# EasyEDA Pro project Sensor_colis_examples.epro, board 2024-06-03_06-32-39
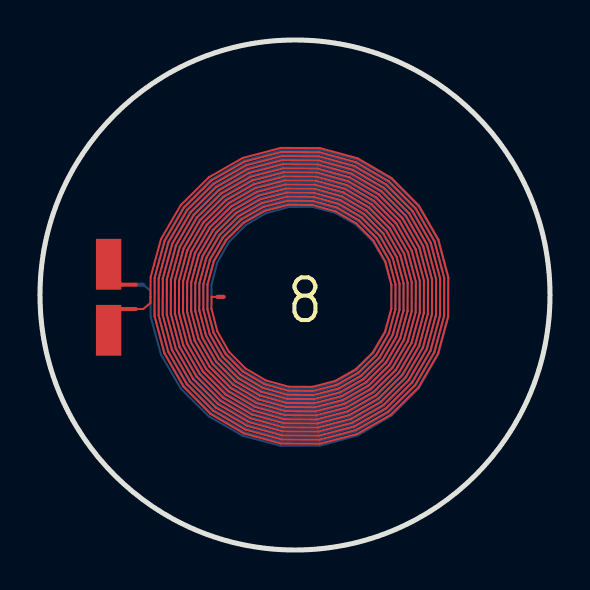
[diagram p14: board, top side]
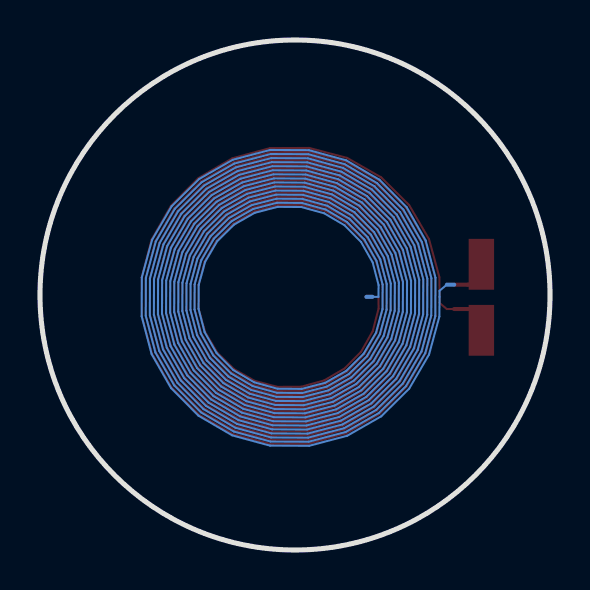
[diagram p15: board, bottom side, seen from below]

Outline 25.51 x 25.51 mm; copper layers: Top Layer, MidLayer1, MidLayer2, Bottom Layer. Coordinates in mm from the lower left corner of the outline.
Outline path: circle c12.75,12.75 r12.75
Stack: Top Layer 0.0356mm / SUBSTRATE1 0.32mm FR-4 er 4.8 / SUBSTRATE4 0.32mm FR-4 er 4.8 / SUBSTRATE5 0.32mm FR-4 er 4.8 / MidLayer1 0.0356mm / SUBSTRATE2 0.32mm FR-4 er 4.8 / MidLayer2 0.0356mm / SUBSTRATE3 0.32mm FR-4 er 4.8 / Bottom Layer 0.0356mm

## Design rules (mm)
spacing safeClearance (default): track to track 0.152, other pairs 0.152 to 0.3
track width trackWidth (default): min 0.127, default 0.254, max 2.54
differential pair differentialPair (default): width min 0.127, default 0.254, max 2.54; gap min 0.152, default 0.152
via viaSize (default): diameter min 0.5, default 0.61, max 10; hole min 0.3, default 0.305, max 6

## Placement (name value [footprint] x y rotation side)
CSENSOR  -  [0402]  3.43 12.75 90 top

## Footprints (pads in the part's own frame, mm; a bottom-side part is the same pattern mirrored in y, then rotated)
0402
  rect 2.54x1.27 smd: 1(-1.766,0) 2(1.536,0)

## Nets
3: CSENSOR.1 CSENSOR.2

## Routing (per net, layer and track width the routed paths; a pad name or vN(x,y) marks a point on that pad's centre or on a via; arc(x,y) is an arc through that point)
3: length 1138.4
  Top Layer w0.102: 4.79,12.05 5.16,12.05 5.53,12.36 5.53,12.66 5.53,13.65 6.05,15.55 7.04,17.25 8.44,18.64 10.15,19.61 12.04,20.11 14,20.1 15.89,19.59 17.58,18.6 18.96,17.21 19.93,15.52 20.42,13.64 20.41,11.69 19.9,9.81 18.92,8.13 17.55,6.77 15.86,5.81 13.99,5.31 12.06,5.32 10.2,5.83 8.53,6.8 7.17,8.17 6.22,9.84 5.73,11.7 5.74,13.62 6.24,15.47 7.21,17.13 8.57,18.47 10.22,19.42 12.07,19.91 13.98,19.9 15.82,19.4 17.46,18.44 18.8,17.09 19.74,15.44 20.22,13.61 20.21,11.72 19.71,9.89 18.76,8.26 17.42,6.93 15.79,6 13.97,5.52 12.09,5.53 10.27,6.02 8.65,6.96 7.34,8.3 6.41,9.92 5.93,11.73 5.94,13.59 6.43,15.39 7.37,17 8.69,18.31 10.3,19.23 12.1,19.7 13.95,19.69 15.74,19.21 17.33,18.28 18.63,16.96 19.55,15.36 20.02,13.58 20.01,11.74 19.52,9.97 18.6,8.38 17.3,7.09 15.71,6.19 13.94,5.72 12.11,5.73 10.35,6.21 8.78,7.13 7.5,8.42 6.6,10 6.13,11.75 6.14,13.57 6.62,15.31 7.53,16.88 8.82,18.15 10.38,19.04 12.12,19.5 13.92,19.49 15.66,19.02 17.21,18.11 18.47,16.84 19.36,15.28 19.81,13.55 19.8,11.77 19.33,10.05 18.44,8.51 17.17,7.26 15.63,6.37 13.91,5.92 12.14,5.93 10.43,6.4 8.9,7.29 7.66,8.54 6.79,10.08 6.34,11.78 6.35,13.54 6.81,15.24 7.69,16.75 8.94,17.98 10.46,18.85 12.15,19.3 13.9,19.29 15.58,18.83 17.08,17.95 18.31,16.71 19.17,15.21 19.61,13.53 19.6,11.8 19.15,10.13 18.27,8.63 17.05,7.42 15.55,6.56 13.89,6.13 12.17,6.14 10.51,6.59 9.03,7.45 7.82,8.67 6.98,10.16 6.54,11.81 6.55,13.51 7,15.16 7.86,16.63 9.06,17.82 10.54,18.66 12.18,19.09 13.87,19.09 15.5,18.64 16.96,17.79 18.15,16.59 18.98,15.13 19.41,13.5 19.4,11.82 18.96,10.2 18.11,8.76 16.92,7.58 15.47,6.75 13.86,6.33 12.19,6.34 10.59,6.78 9.15,7.62 7.99,8.79 7.16,10.23 6.74,11.83 6.75,13.49 7.19,15.08 8.02,16.5 9.19,17.66 10.62,18.47 12.2,18.89 13.84,18.88 15.42,18.45 16.83,17.63 17.98,16.47 18.79,15.05 19.2,13.47 19.2,11.85 18.77,10.28 17.95,8.88 16.8,7.74 15.39,6.94 13.83,6.53 12.22,6.54 10.67,6.97 9.28,7.78 8.15,8.92 7.35,10.31 6.95,11.86 6.96,13.46 7.38,15 8.18,16.38 9.31,17.5 10.7,18.28 12.23,18.69 13.82,18.68 15.34,18.26 16.71,17.46 17.82,16.34 18.6,14.97 19,13.45 18.99,11.88 18.58,10.36 17.79,9.01 16.67,7.91 15.32,7.13 13.8,6.74 12.25,6.74 10.74,7.16 9.4,7.94 8.31,9.04 7.54,10.39 7.15,11.89 7.16,13.43 7.57,14.92 8.34,16.25 9.44,17.33 10.77,18.1 12.26,18.48 13.79,18.48 15.27,18.07 16.58,17.3 17.66,16.22 18.41,14.89 18.8,13.42 18.79,11.9 18.39,10.44 17.62,9.13 16.55,8.07 15.24,7.32 13.78,6.94 12.27,6.95 10.82,7.35 9.53,8.1 8.47,9.17 7.73,10.47 7.35,11.91 7.36,13.41 7.76,14.84 8.51,16.13 9.56,17.17 10.85,17.91 12.28,18.28 13.76,18.27 15.19,17.88 16.46,17.14 17.49,16.09 18.22,14.81 18.59,13.39 18.59,11.93 18.2,10.52 17.46,9.26 16.42,8.23 15.16,7.51 13.75,7.14 12.3,7.15 10.9,7.53 9.65,8.27 8.64,9.29 7.92,10.55 7.56,11.94 7.57,13.38 7.95,14.76 8.67,16 9.69,17.01 10.93,17.72 12.31,18.08 13.74,18.07 15.11,17.69 16.34,16.98 17.33,15.97 18.03,14.74 18.39,13.37 18.38,11.96 18.01,10.6 17.3,9.38 16.3,8.39 15.08,7.7 13.72,7.35 12.33,7.35 10.98,7.72 9.78,8.43 8.8,9.42 8.11,10.63 7.76,11.97 7.77,13.35 8.14,14.69 8.83,15.88 9.81,16.85 11.01,17.53 12.34,17.87 13.71,17.87 15.03,17.5 16.21,16.81 17.17,15.84 17.84,14.66 18.19,13.34 18.18,11.98 17.82,10.67 17.14,9.51 16.17,8.56 15,7.89 13.7,7.55 12.35,7.56 11.06,7.91 9.9,8.59 8.96,9.54 8.3,10.7 7.96,11.99 7.97,13.33 8.32,14.61 9,15.75 9.94,16.68 11.09,17.34 12.37,17.67 13.68,17.66 14.95,17.31 16.09,16.65 17.01,15.72 17.65,14.58 17.98,13.31 17.98,12.01 17.63,10.75 16.97,9.63 16.05,8.72 14.92,8.08 13.67,7.75 12.38,7.76 11.14,8.1 10.03,8.75 9.12,9.67 8.49,10.78 8.17,12.02 8.18,13.3 8.51,14.53 9.16,15.63 10.06,16.52 11.17,17.15 12.39,17.47 13.66,17.46 14.87,17.12 15.96,16.49 16.84,15.59 17.46,14.5 17.78,13.29 17.77,12.04 17.44,10.83 16.81,9.76 15.92,8.88 14.84,8.27 13.64,7.96 12.41,7.96 11.22,8.29 10.15,8.92 9.29,9.79 8.68,10.86 8.37,12.05 8.38,13.27 8.7,14.45 9.32,15.5 10.19,16.36 11.24,16.96 12.42,17.27 13.63,17.26 14.8,16.94 15.84,16.32 16.68,15.47 17.28,14.42 17.58,13.26 17.57,12.06 17.25,10.91 16.65,9.88 15.8,9.04 14.77,8.46 13.62,8.16 12.43,8.17 11.29,8.48 10.28,9.08 9.45,9.92 8.87,10.94 8.57,12.08 8.58,12.66 8.88,12.66
  Top Layer w0.203: 4.79,12.05 3.43,12.05 ; 8.88,12.66 9.18,12.66 ; 3.43,13.45 3.43,13.36 4.11,13.27 4.79,13.27
  Bottom Layer w0.102: 8.88,12.66 8.58,12.66 8.57,13.25 8.87,14.38 9.45,15.4 10.28,16.24 11.29,16.84 12.43,17.15 13.62,17.16 14.77,16.86 15.8,16.28 16.65,15.44 17.25,14.41 17.57,13.26 17.58,12.06 17.28,10.9 16.68,9.86 15.84,9 14.8,8.39 13.63,8.07 12.42,8.06 11.24,8.36 10.19,8.96 9.32,9.82 8.7,10.87 8.38,12.05 8.37,13.27 8.68,14.46 9.29,15.53 10.15,16.41 11.22,17.03 12.41,17.36 13.64,17.37 14.84,17.05 15.92,16.44 16.81,15.57 17.44,14.49 17.77,13.29 17.78,12.03 17.46,10.82 16.84,9.73 15.96,8.83 14.87,8.2 13.66,7.86 12.39,7.85 11.17,8.17 10.06,8.8 9.16,9.69 8.51,10.79 8.18,12.02 8.17,13.3 8.49,14.54 9.12,15.65 10.03,16.57 11.14,17.22 12.38,17.56 13.67,17.57 14.92,17.24 16.05,16.6 16.97,15.69 17.63,14.57 17.98,13.31 17.98,12.01 17.65,10.74 17.01,9.61 16.09,8.67 14.95,8.01 13.68,7.66 12.37,7.65 11.09,7.98 9.94,8.64 9,9.57 8.32,10.71 7.97,12 7.96,13.33 8.3,14.62 8.96,15.78 9.9,16.73 11.06,17.41 12.35,17.76 13.7,17.77 15,17.43 16.17,16.77 17.14,15.82 17.82,14.65 18.18,13.34 18.19,11.98 17.84,10.67 17.17,9.48 16.21,8.51 15.03,7.82 13.71,7.46 12.34,7.45 11.01,7.79 9.81,8.48 8.83,9.44 8.14,10.64 7.77,11.97 7.76,13.35 8.11,14.7 8.8,15.9 9.78,16.89 10.98,17.6 12.33,17.97 13.72,17.98 15.08,17.62 16.3,16.93 17.3,15.94 18.01,14.73 18.38,13.37 18.39,11.95 18.03,10.59 17.33,9.36 16.34,8.35 15.11,7.63 13.74,7.25 12.31,7.24 10.93,7.61 9.69,8.31 8.67,9.32 7.95,10.56 7.57,11.94 7.56,13.38 7.92,14.77 8.64,16.03 9.65,17.06 10.9,17.79 12.3,18.17 13.75,18.18 15.16,17.81 16.42,17.09 17.46,16.07 18.2,14.8 18.59,13.39 18.59,11.93 18.22,10.51 17.49,9.23 16.46,8.18 15.19,7.44 13.76,7.05 12.28,7.04 10.85,7.42 9.56,8.15 8.51,9.19 7.76,10.48 7.36,11.92 7.35,13.41 7.73,14.85 8.47,16.15 9.53,17.22 10.82,17.98 12.27,18.37 13.78,18.38 15.24,18 16.55,17.25 17.62,16.19 18.39,14.88 18.79,13.42 18.8,11.9 18.41,10.43 17.66,9.11 16.58,8.02 15.27,7.25 13.79,6.85 12.26,6.84 10.77,7.23 9.44,7.99 8.34,9.07 7.57,10.4 7.16,11.89 7.15,13.43 7.54,14.93 8.31,16.28 9.4,17.38 10.74,18.17 12.25,18.58 13.8,18.59 15.32,18.19 16.67,17.42 17.79,16.31 18.58,14.96 18.99,13.45 19,11.87 18.6,10.35 17.82,8.98 16.71,7.86 15.34,7.06 13.82,6.64 12.23,6.63 10.7,7.04 9.31,7.83 8.18,8.95 7.38,10.32 6.96,11.86 6.95,13.46 7.35,15.01 8.15,16.4 9.28,17.54 10.67,18.36 12.22,18.78 13.83,18.79 15.39,18.38 16.8,17.58 17.95,16.44 18.77,15.04 19.2,13.47 19.2,11.85 18.79,10.27 17.98,8.86 16.83,7.7 15.42,6.87 13.84,6.44 12.2,6.43 10.62,6.85 9.19,7.66 8.02,8.82 7.19,10.24 6.75,11.84 6.74,13.49 7.16,15.09 7.99,16.53 9.15,17.71 10.59,18.55 12.19,18.98 13.86,18.99 15.47,18.57 16.92,17.74 18.11,16.56 18.96,15.12 19.4,13.5 19.41,11.82 18.98,10.19 18.15,8.73 16.96,7.53 15.5,6.68 13.87,6.24 12.18,6.23 10.54,6.66 9.06,7.5 7.86,8.7 7,10.17 6.55,11.81 6.54,13.51 6.98,15.17 7.82,16.65 9.03,17.87 10.51,18.73 12.17,19.19 13.89,19.2 15.55,18.76 17.05,17.9 18.27,16.69 19.15,15.2 19.6,13.53 19.61,11.79 19.17,10.12 18.31,8.61 17.08,7.37 15.58,6.49 13.9,6.03 12.15,6.03 10.46,6.47 8.94,7.34 7.69,8.57 6.81,10.09 6.35,11.78 6.34,13.54 6.79,15.25 7.66,16.78 8.9,18.03 10.43,18.92 12.14,19.39 13.91,19.4 15.63,18.95 17.17,18.07 18.44,16.81 19.33,15.27 19.8,13.55 19.81,11.77 19.36,10.04 18.47,8.48 17.21,7.21 15.66,6.3 13.92,5.83 12.12,5.82 10.38,6.28 8.82,7.17 7.53,8.45 6.62,10.01 6.14,11.76 6.13,13.57 6.6,15.32 7.5,16.9 8.78,18.19 10.35,19.11 12.11,19.59 13.94,19.6 15.71,19.14 17.3,18.23 18.6,16.94 19.52,15.35 20.01,13.58 20.02,11.74 19.55,9.96 18.63,8.36 17.33,7.05 15.74,6.11 13.95,5.63 12.1,5.62 10.3,6.09 8.69,7.01 7.37,8.32 6.43,9.93 5.94,11.73 5.93,13.59 6.41,15.4 7.34,17.03 8.65,18.36 10.27,19.3 12.09,19.8 13.97,19.81 15.79,19.33 17.42,18.39 18.76,17.06 19.71,15.43 20.21,13.61 20.22,11.71 19.74,9.88 18.8,8.23 17.46,6.88 15.82,5.93 13.98,5.42 12.07,5.42 10.22,5.9 8.57,6.85 7.21,8.2 6.24,9.85 5.74,11.7 5.73,13.62 6.22,15.48 7.17,17.15 8.53,18.52 10.2,19.49 12.06,20 13.99,20.01 15.86,19.52 17.55,18.55 18.92,17.19 19.9,15.51 20.41,13.63 20.42,11.69 19.93,9.8 18.96,8.11 17.58,6.72 15.89,5.74 14,5.22 12.04,5.21 10.15,5.71 8.44,6.69 7.04,8.07 6.05,9.77 5.53,11.67 5.53,12.66 5.53,12.97 5.16,13.27
  Bottom Layer w0.203: 8.88,12.66 9.18,12.66 ; 5.16,13.27 4.79,13.27

## Text on the board
Top Silkscreen Layer: Layers = 2 | Turns = 15 | Version - 1.1 | -------------- | Design Id - 110 | Coil Parameters | Customized for LDC1612 | Trace Width = 4.0 mils | Layer Stack Information | Trace Spacing = 4.0 mils | ------------------------- | WEBENCH Design Information | Copper thickness = 1.0 Oz-Cu | Exported on - 2024/06/03 06:32:37 | Inner Diameter = 351 mils (Approx.) | Outer Diameter = 591 mils (Approx.) | Space between TOP and BOTTOM = 4.0 mils | Exported from WEBENCH Coil Designer Tool | 8
